# Altium schematic sheet Switch.SchDoc: SWITCH
size A4; Author: MOG; CompanyName: GIE GROUP; DrawnBy: MOG; Organization: Gie SA; Address1: Galicia 52; Address2: Mar del Plata; Address3: Buenos Aires; Address4: Argentina; DocumentNumber: 8; Revision: 0.0; SheetNumber: 9; SheetTotal: 14; Project: CP DATALOGGER; PageSetup: Record=PageOptions|CenterHorizontal=True|CenterVertical=True|PrintScale=0.94|XCorrection=1.00|YCorrection=1.00|PrintKind=0|BorderSize=5000000|LeftOffset=0|BottomOffset=0|Orientation=2|PaperLength=1000|PaperWidth=1000|Scale=100|PaperSource=7|PrintQuality=720|MediaType=1|DitherType=10|PaperKind=A4|PrintScaleMode=1
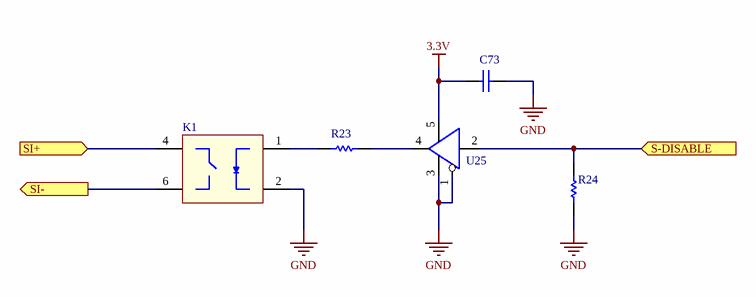
[diagram p0: Switch.SchDoc]

## Parts
C73  C0603C104K5RACAUTO  [CAP-0603]  (value not drawn)
K1  (no value)  [SMD6]
R23  RC0603FR-07453RL  [RES-0603]  (value not drawn)
R24  RC0603FR-07100KL  [RES-0603]  (value not drawn)
U25  (no value)  [SOT23-5]

## Ports
S-DISABLE (in), SI+ (in), SI- (out)

## Nets
3.3V: C73.1 U25.5(VCC)
GND: C73.2 K1.2 R24.1 U25.1(OE) U25.3(GND)
S-DISABLE: R24.2 U25.2(A) ; port S-DISABLE
SI+: K1.4 ; port SI+
SI-: K1.6 ; port SI-
NetK1_1: K1.1 R23.1
NetR23_2: R23.2 U25.4(Y)

## Notes on the sheet
- PROYECTO:
- Rev:
- NOMBRE:
- FECHA:
- REALIZO:
- REVISO:
- APROBO:
- PAG:
- HOJA:
- DE
- A4

## Library data of the parts
C73 = C0603C104K5RACAUTO: CAP CER 0.1uF 50V X7R 0603; Manufacturer: Kemet; Tolerance: 10%; Voltage: 50; PartNumber: C0603C104K5RACAUTO; Supplier 1: Digi-Key; Supplier 2: Mouser; Supplier Part Number 1: 399-6856-1-ND; Supplier Part Number 2: 80-C0603C104K5RAUTO
K1 = LCB716S: SSR RELAY SPST-NC 500MA 0-60V; Manufacturer: Ixys
R23 = RC0603FR-07453RL: RES SMD 453 OHM 1% 1/10W 0603; Manufacturer: Yageo; Power: 0.1W; Tolerance: 1%; PartNumber: RC0603FR-07453RL; Supplier 1: Digi-Key; Supplier 2: Mouser; Supplier Part Number 1: 311-887KHRCT-ND; Supplier Part Number 2: 603-RC0603FR-07887KL
R24 = RC0603FR-07100KL: RES SMD 100K OHM 1% 1/10W 0603; Manufacturer: Yageo; Power: 0.1W; Tolerance: 1%; PartNumber: RC0603FR-07100KL; Supplier 1: Digi-Key; Supplier 2: Mouser; Supplier Part Number 1: 311-100KHRCT-ND; Supplier Part Number 2: 603-RC0603FR-07100KL
U25 = NC7SZ125M5X: IC BUFF TRI-ST UHS N-INV SOT23-5; Manufacturer: Fairchild Semiconductor; Supplier 1: Digi-Key; Supplier Part Number 1: NC7SZ125M5CT-ND; Supplier 2: Mouser; Supplier Part Number 2: 512-NC7SZ125M5X